# Altium schematic sheet theremin.SchDoc
size Letter
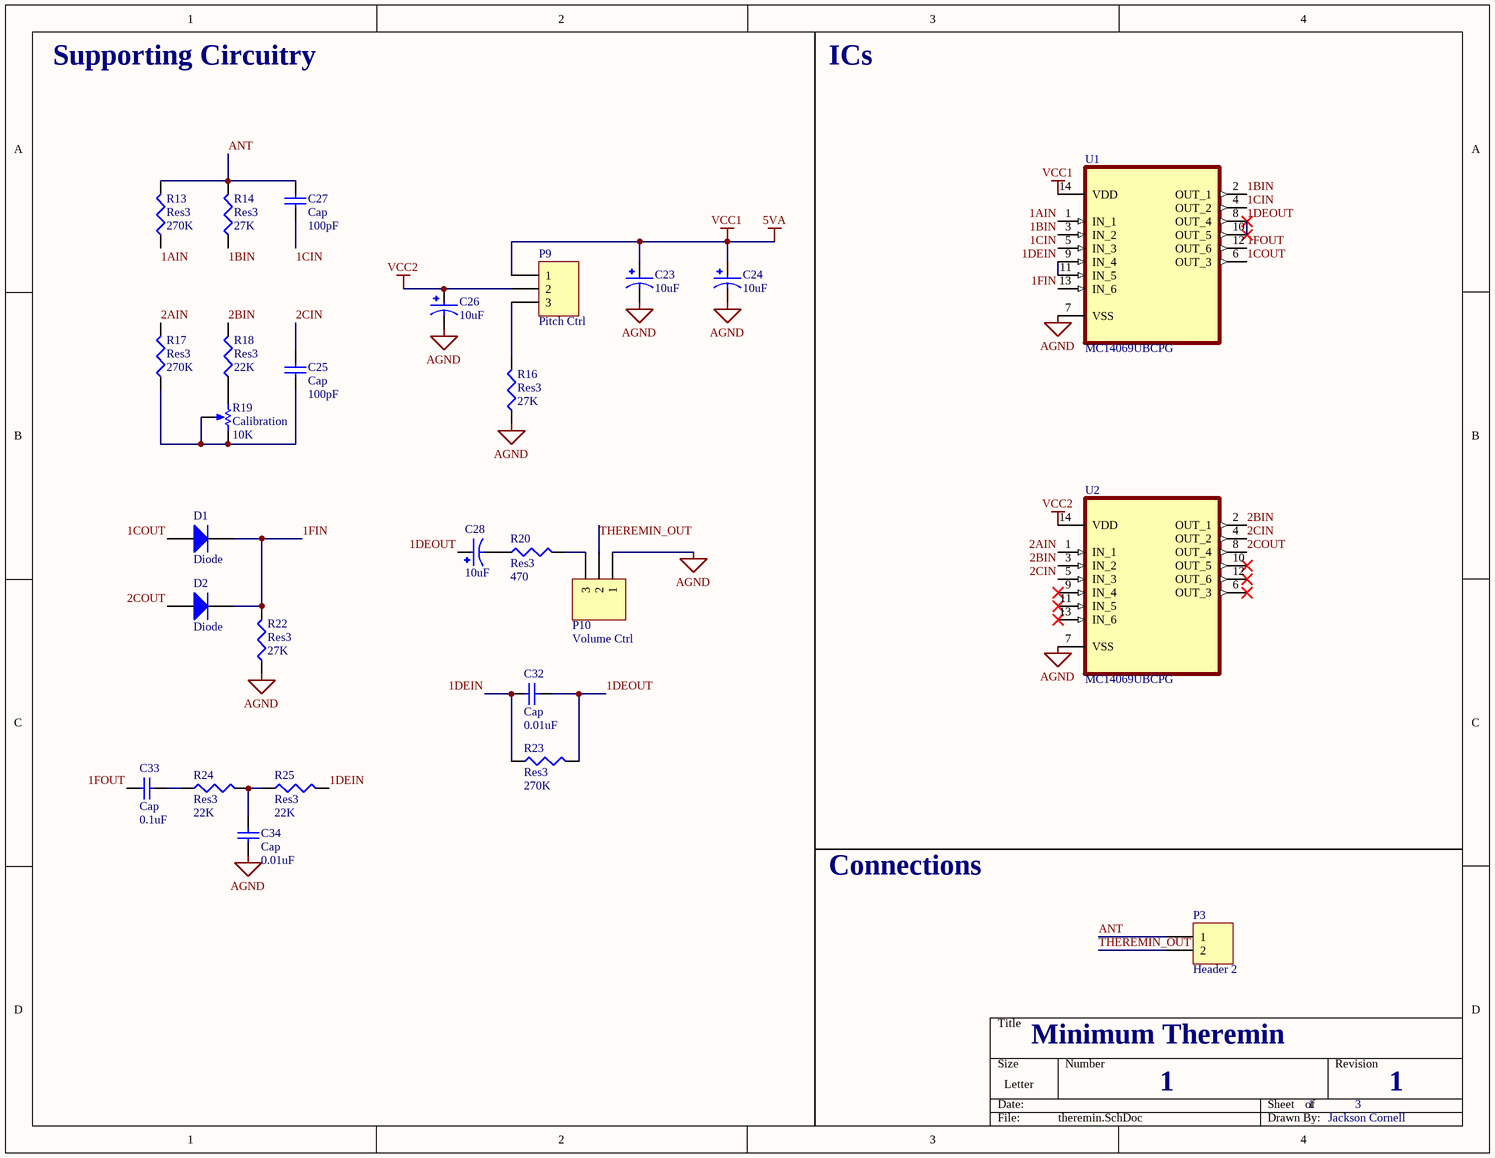
[diagram p0: theremin.SchDoc]

## Parts
C23  value 10uF  [CAPPRD500W60D1000H1250]  (hidden comment: EEUFC1V221E)
C24  value 10uF  [CAPPRD500W60D1000H1250]  (hidden comment: EEUFC1V221E)
C25  Cap  value 100pF  [CAPC0805]
C26  value 10uF  [CAPPRD500W60D1000H1250]  (hidden comment: EEUFC1V221E)
C27  Cap  value 100pF  [CAPC0805]
C28  value 10uF  [CAPPRD500W60D1000H1250]  (hidden comment: EEUFC1V221E)
C32  Cap  value 0.01uF  [CAPC0805]
C33  Cap  value 0.1uF  [CAPC0805]
C34  Cap  value 0.01uF  [CAPC0805]
D1  Diode  [SMC]
D2  Diode  [SMC]
P3  Header 2  [HDR1X2]
P9  Pitch Ctrl  [HDR1X3]
P10  Volume Ctrl  [HDR1X3]
R13  Res3  value 270K  [RES0805]
R14  Res3  value 27K  [RES0805]
R16  Res3  value 27K  [RES0805]
R17  Res3  value 270K  [RES0805]
R18  Res3  value 22K  [RES0805]
R19  Calibration  value 10K  [VR5]
R20  Res3  value 470  [RES0805]
R22  Res3  value 27K  [RES0805]
R23  Res3  value 270K  [RES0805]
R24  Res3  value 22K  [RES0805]
R25  Res3  value 22K  [RES0805]
U1  MC14069UBCPG  [DIP254P762X469-14]
U2  MC14069UBCPG  [DIP254P762X469-14]

## Nets
5VA: C23.P C24.P P9.1 U1.14(VDD)  [also labelled VCC1]
AGND: C23.N C24.N C26.N C34.1 P10.1 R16.1 R22.1 U1.7(VSS) U2.7(VSS)
VCC2: C26.P P9.2 U2.14(VDD)
1AIN: R13.1 U1.1(IN_1)
1BIN: R14.1 U1.2(OUT_1) U1.3(IN_2)
1CIN: C27.1 U1.4(OUT_2) U1.5(IN_3)
1COUT: D1.1(A) U1.6(OUT_3)
1DEIN: C32.1 R23.1 R25.2 U1.9(IN_4) U1.11(IN_5)
1DEOUT: C28.P C32.2 R23.2 U1.8(OUT_4) U1.10(OUT_5)
1FIN: D1.2(K) D2.2(K) R22.2 U1.13(IN_6)
1FOUT: C33.1 U1.12(OUT_6)
2AIN: R17.2 U2.1(IN_1)
2BIN: R18.2 U2.2(OUT_1) U2.3(IN_2)
2CIN: C25.2 U2.4(OUT_2) U2.5(IN_3)
2COUT: D2.1(A) U2.8(OUT_4)
ANT: C27.2 P3.1 R13.2 R14.2
THEREMIN_OUT: P3.2 P10.2
NetC25_1: C25.1 R17.1 R19.2(BOT) R19.3(TAP)
NetC28_N: C28.N R20.1
NetC33_2: C33.2 R24.1
NetC34_2: C34.2 R24.2 R25.1
NetP9_3: P9.3 R16.2
NetP10_3: P10.3 R20.2
NetR18_1: R18.1 R19.1(TOP)

Not connected (* = marked no-connect by the designer): U2 6(OUT_3)* 9(IN_4)* 10(OUT_5)* 11(IN_5)* 12(OUT_6)* 13(IN_6)*

## Notes on the sheet
- Supporting Circuitry
- ICs
- Connections
- Minimum Theremin
- 1
- 3
- Jackson Cornell

## Library data of the parts
C23 C24 C26 C28 = EEUFC1V221E: Aluminum Electrolytic Capacitors - Radial Leaded; MP: EEU-FC1V221E; MF: Panasonic; SnapEDA_Link: https://www.snapeda.com/parts/EEU-FC1V221E/Panasonic/view-part/6222388/?ref=snap; Availability: In Stock; Purchase-URL: https://pricing.snapeda.com/search/part/EEU-FC1V221E/?ref=eda; Check_prices: https://www.snapeda.com/parts/EEU-FC1V221E/Panasonic/view-part/6222388/?ref=eda; Package: RADIAL-2 Panasonic; Price: None
C25 C27 C32-C34 = Cap: Capacitor; Published: 8-Jun-2000; LatestRevisionDate: 17-Jul-2002; LatestRevisionNote: Re-released for DXP Platform.; PackageReference: RAD-0.3; Publisher: Altium Limited; PackageDescription: Radial Cap, Thru-Hole; 2 Leads; 0.3 in Pin Spacing
D1 D2 = Diode: Default Diode; Published: 8-Jun-2000; LatestRevisionDate: 17-Jul-2002; LatestRevisionNote: Re-released for DXP Platform.; PackageVersion: Sep-1996; PackageReference: SMC; Publisher: Altium Limited; PackageDescription: DO-214-AB/SMC; 2 C-Bend Leads; Body 7.9 x 5.9 mm, inc. leads (LxW); Code_JEDEC: DO-214-AB
P3 = Header 2: Header, 2-Pin; LatestRevisionDate: 17-Jul-2002; LatestRevisionNote: Re-released for DXP Platform.; Publisher: Altium Limited
P9 P10 = Header 3: Header, 3-Pin; LatestRevisionDate: 17-Jul-2002; LatestRevisionNote: Re-released for DXP Platform.; Publisher: Altium Limited
R13 R14 R16-R18 R20 R22-R25 = Res3: Resistor; Published: 8-Jun-2000; LatestRevisionDate: 29-May-2009; LatestRevisionNote: IPC-7351 Footprint Added.; PackageReference: J1-0603; Publisher: Altium Limited; PackageDescription: Chip Resistor
R19 = RPot: Potentiometer; Sim Note: Enter the Resistance value and the set point into parameter fields.; Set Position: 0.5; Published: 8-Jun-2000; LatestRevisionDate: 17-Jul-2002; LatestRevisionNote: Re-released for DXP Platform.; PackageReference: VR5; Publisher: Altium Limited; PackageDescription: Variable Resistor, Thru-Hole; 3 Leads
U1 U2 = MC14069UBCPG: Inverter IC 6 Channel - 14-PDIP; MF: ON Semiconductor; Price: None; Value: *; Package: DIP-14 Motorola; SnapEDA_Link: https://www.snapeda.com/parts/MC14069UBCPG/Onsemi/view-part/?ref=snap; Check_prices: https://www.snapeda.com/parts/MC14069UBCPG/Onsemi/view-part/?ref=eda; Availability: In Stock; MP: MC14069UBCPG